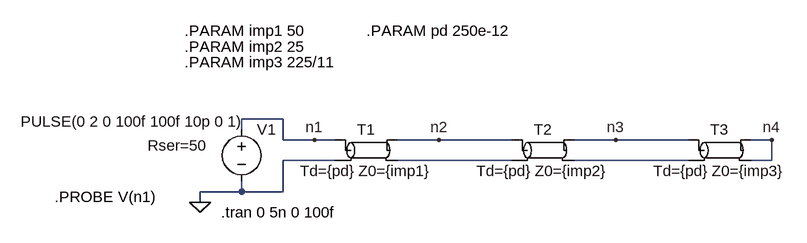
[diagram p0: schematic model.asc]
model.asc, the LTspice schematic file:
Version 4
SHEET 1 912 680
WIRE 112 112 48 112
WIRE 48 128 48 112
WIRE 112 144 112 112
WIRE 160 144 112 144
WIRE 192 144 160 144
WIRE 352 144 288 144
WIRE 464 144 352 144
WIRE 624 144 560 144
WIRE 736 144 624 144
WIRE 864 144 832 144
WIRE 192 176 112 176
WIRE 464 176 288 176
WIRE 736 176 560 176
WIRE 864 176 864 144
WIRE 864 176 832 176
WIRE 48 224 48 208
WIRE 48 224 -16 224
WIRE 112 224 112 176
WIRE 112 224 48 224
WIRE -16 240 -16 224
FLAG -16 240 0
FLAG 160 144 n1
FLAG 352 144 n2
FLAG 624 144 n3
FLAG 864 144 n4
SYMBOL voltage 48 112 R0
WINDOW 123 0 0 Left 0
WINDOW 39 -145 41 Left 2
WINDOW 3 -340 4 Left 2
SYMATTR SpiceLine Rser=50
SYMATTR Value PULSE(0 2 0 100f 100f 10p 0 1)
SYMATTR InstName V1
SYMBOL tline 240 160 R0
SYMATTR InstName T1
SYMATTR Value Td={pd} Z0={imp1}
SYMBOL tline 512 160 R0
SYMATTR InstName T2
SYMATTR Value Td={pd} Z0={imp2}
SYMBOL tline 784 160 R0
SYMATTR InstName T3
SYMATTR Value Td={pd} Z0={imp3}
TEXT 16 256 Left 2 !.tran 0 5n 0 100f
TEXT -240 232 Left 2 !.PROBE V(n1)
TEXT -40 -24 Left 2 !.PARAM imp1 50
TEXT -40 0 Left 2 !.PARAM imp2 25
TEXT -40 24 Left 2 !.PARAM imp3 225/11
TEXT 240 -24 Left 2 !.PARAM pd 250e-12

The netlist it stands for:
* model.asc
V1 n1 0 PULSE(0 2 0 100f 100f 10p 0 1) Rser=50
T1 n1 0 n2 N001 Td={pd} Z0={imp1}
T2 n2 N001 n3 N002 Td={pd} Z0={imp2}
T3 n3 N002 n4 n4 Td={pd} Z0={imp3}
.tran 0 5n 0 100f
.PROBE V(n1)
.PARAM imp1 50
.PARAM imp2 25
.PARAM imp3 225/11
.PARAM pd 250e-12
.backanno
.end